# EAGLE design Sensact v3.0 a_backup (EAGLE 7.7.0)
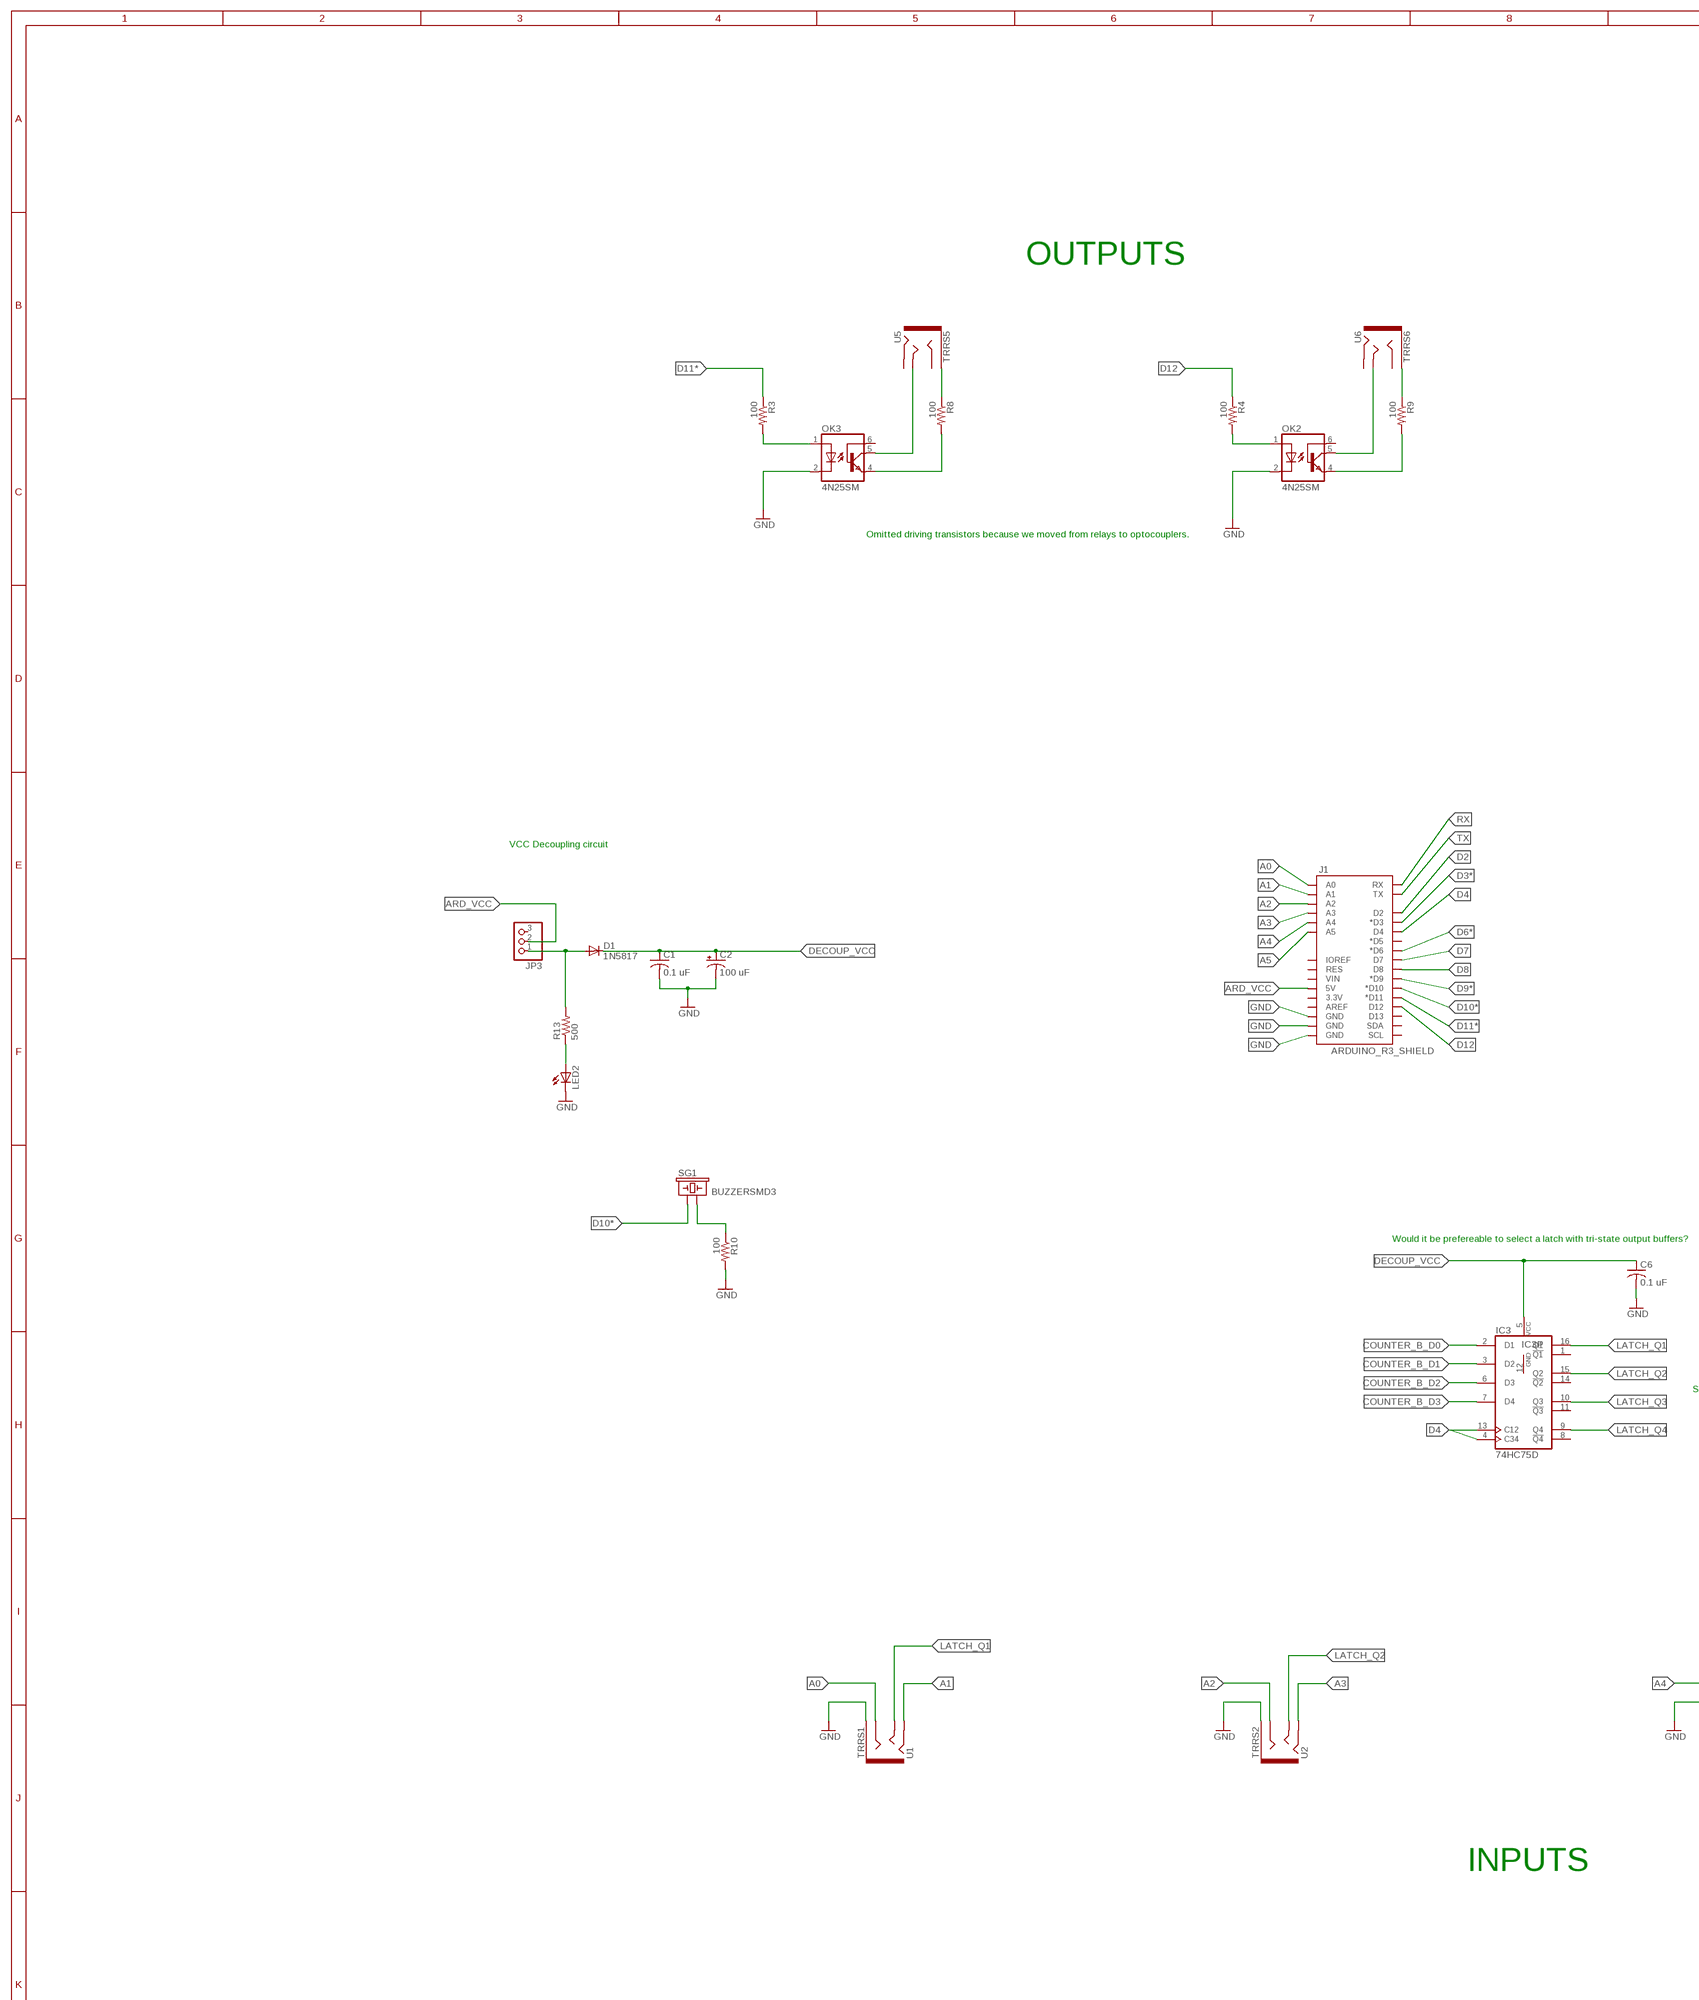
[diagram p0: schematic, sheet 1, part 1 of 3]
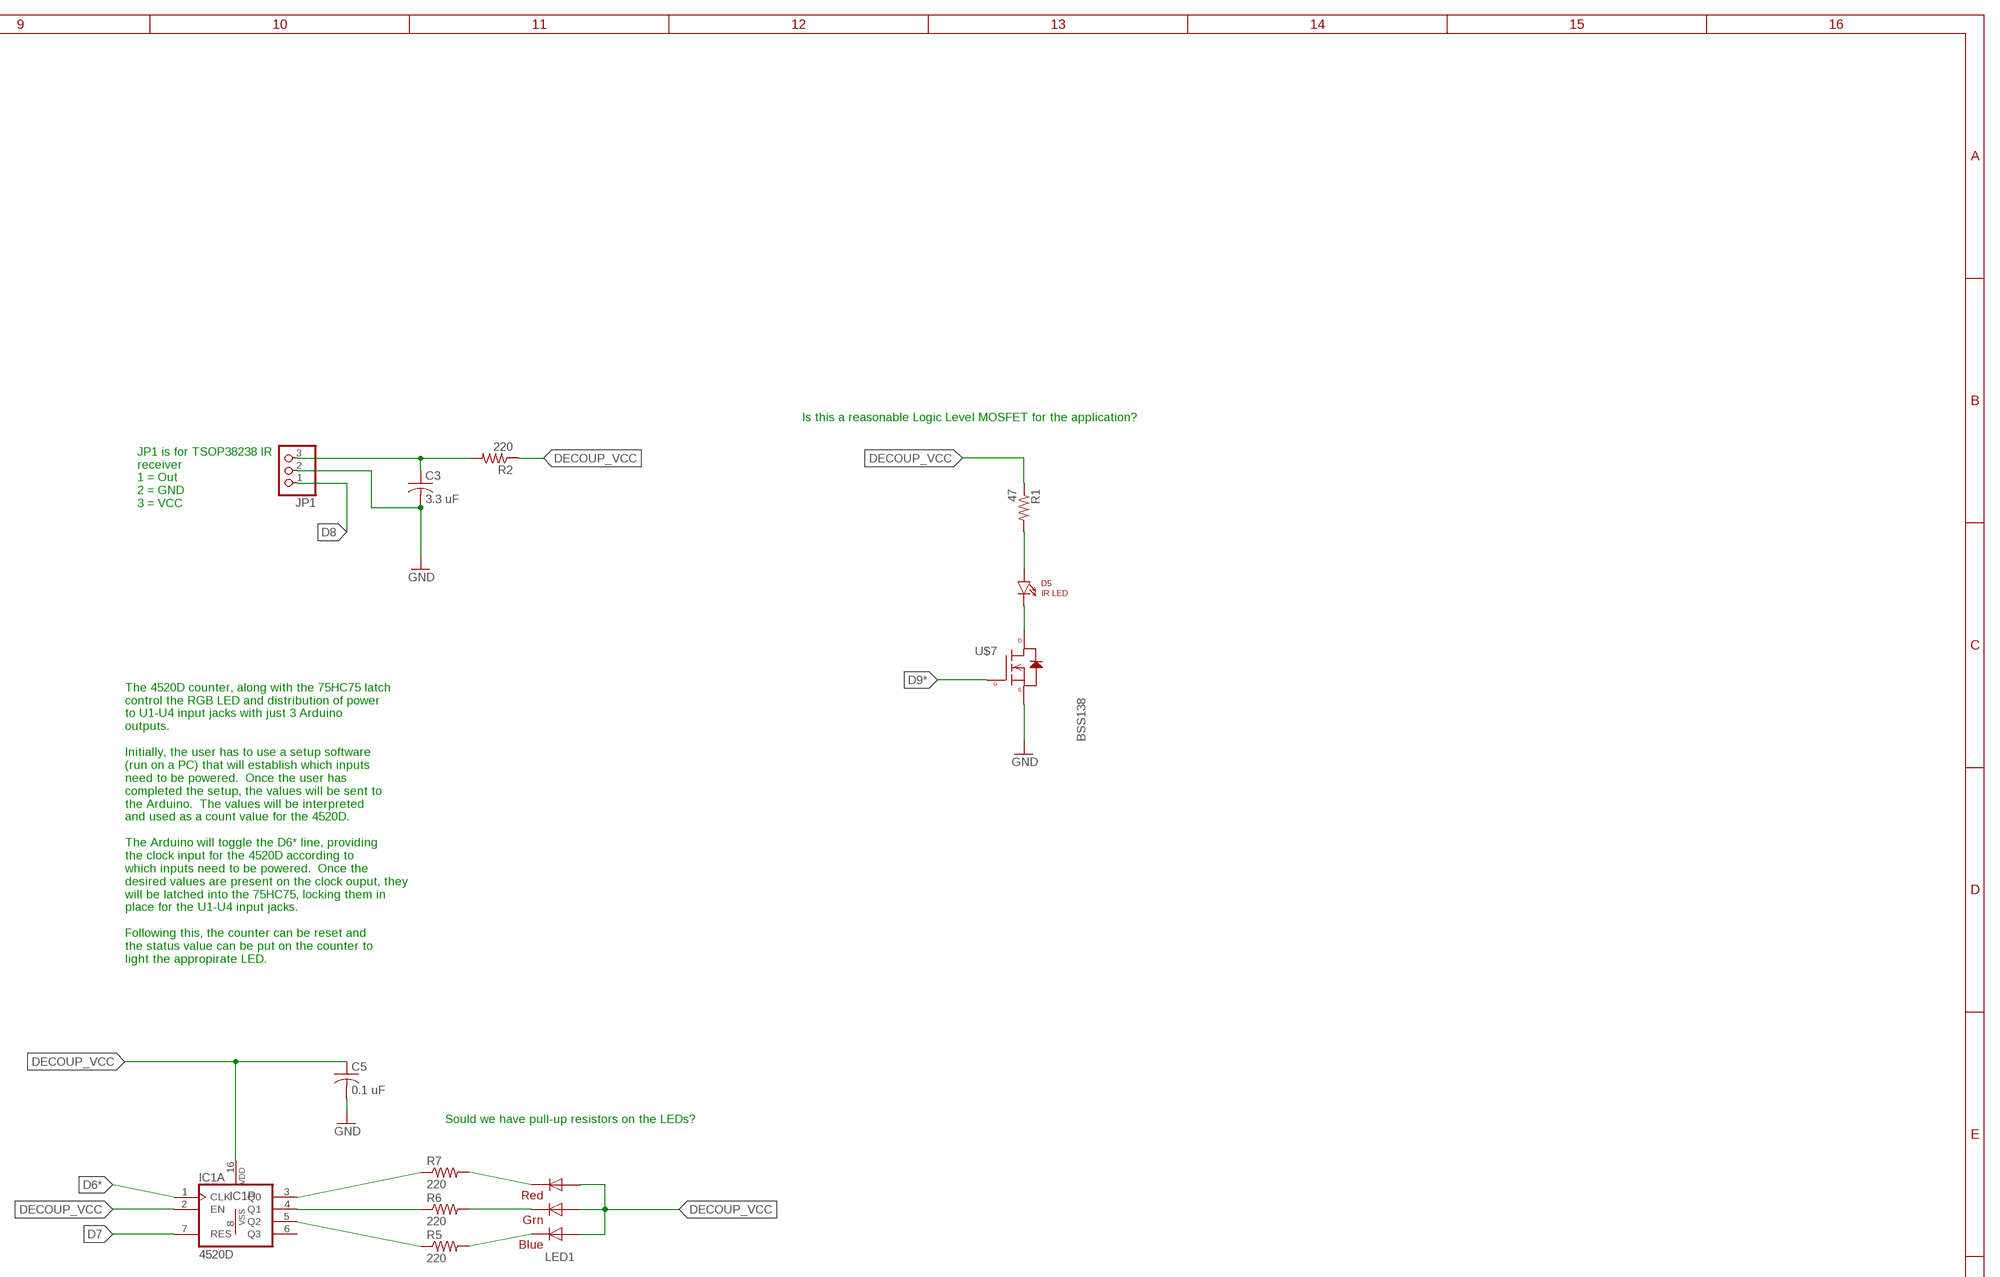
[diagram p1: schematic, sheet 1, part 2 of 3]
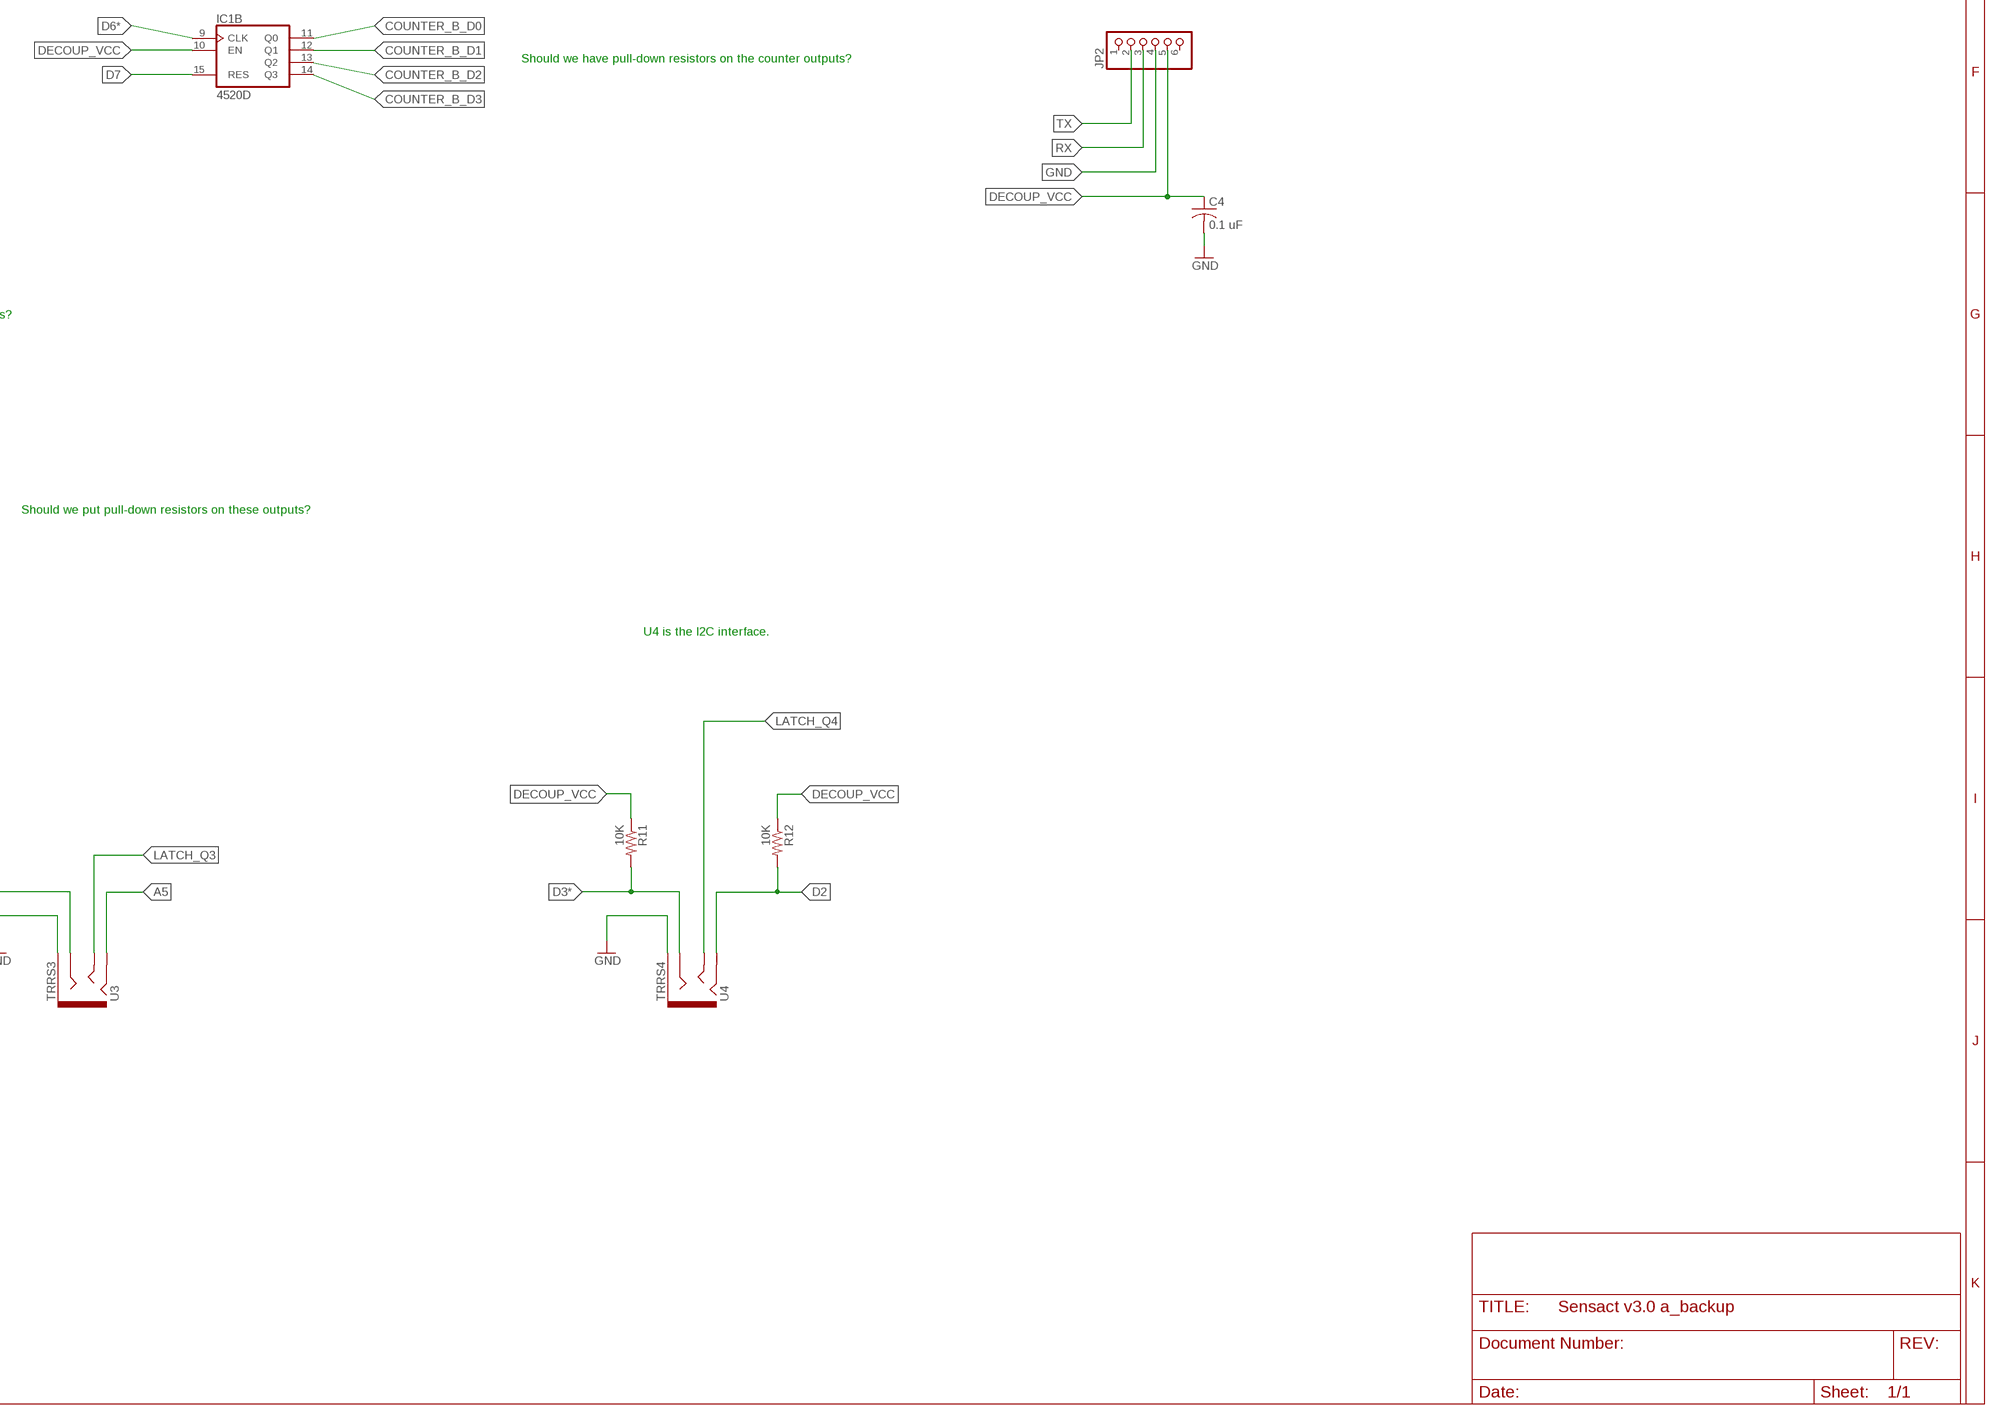
[diagram p2: schematic, sheet 1, part 3 of 3]

## Parts
C1  0.1 uF  C-USC0805  [C0805]
C2  100 uF  CAP_POLC  [PANASONIC_C]
C3  3.3 uF  C-USC0805  [C0805]
C4  0.1 uF  C-USC0805  [C0805]
C5  0.1 uF  C-USC0805  [C0805]
C6  0.1 uF  C-USC0805  [C0805]
D1  1N5817  DIODE-DO214AC  [DO214AC]
D5  IR LED  LTE-302  [LTE-302]
IC1  4520D  [SO16]
IC3  74HC75D  [SO16]
J1  ARDUINO_R3_SHIELD  [UNO_R3_SHIELD]
JP1  PINHD-1X3  [1X03]
JP2  PINHD-1X6  [1X06]
JP3  PINHD-1X3  [1X03]
LED1  RGBLED5050  [RGBLED5050]
LED2  LEDCHIPLED_0805  [CHIPLED_0805]
OK2  4N25SM  [DIL6-SMD]
OK3  4N25SM  [DIL6-SMD]
R1  47  RESISTOR0805-RES  [0805]
R2  220  RESISTOR0805-RES  [0805]
R3  100  RESISTOR0805-RES  [0805]
R4  100  RESISTOR0805-RES  [0805]
R5  220  RESISTOR0805-RES  [0805]
R6  220  RESISTOR0805-RES  [0805]
R7  220  RESISTOR0805-RES  [0805]
R8  100  R-US_R0805  [R0805]
R9  100  R-US_R0805  [R0805]
R10  100  R-US_R0805  [R0805]
R11  10K  RESISTOR0805-RES  [0805]
R12  10K  RESISTOR0805-RES  [0805]
R13  500  RESISTOR0805-RES  [0805]
SG1  BUZZERSMD3  [BUZZER-CMT1102]
TRRS1  U1  AUDIO-JACK-TRRS-THRUHOLE  [AUDIO-JACK-TRRS-THRUHOLE]
TRRS2  U2  AUDIO-JACK-TRRS-THRUHOLE  [AUDIO-JACK-TRRS-THRUHOLE]
TRRS3  U3  AUDIO-JACK-TRRS-THRUHOLE  [AUDIO-JACK-TRRS-THRUHOLE]
TRRS4  U4  AUDIO-JACK-TRRS-THRUHOLE  [AUDIO-JACK-TRRS-THRUHOLE]
TRRS5  U5  AUDIO-JACK-TRRS-THRUHOLE  [AUDIO-JACK-TRRS-THRUHOLE]
TRRS6  U6  AUDIO-JACK-TRRS-THRUHOLE  [AUDIO-JACK-TRRS-THRUHOLE]
U$7  BSS138  N-CHANNEL-MOSFET-BSS138  [SOT23-3]

## Nets
A0: J1.A0 TRRS1.RING1
A1: J1.A1 TRRS1.RING2
A2: J1.A2 TRRS2.RING1
A3: J1.A3 TRRS2.RING2
A4: J1.A4 TRRS3.RING1
A5: J1.A5 TRRS3.RING2
ARD_VCC: J1.5V JP3.2
COUNTER_B_D0: IC1.11(B:Q0) IC3.2(D1)
COUNTER_B_D1: IC1.12(B:Q1) IC3.3(D2)
COUNTER_B_D2: IC1.13(B:Q2) IC3.6(D3)
COUNTER_B_D3: IC1.14(B:Q3) IC3.7(D4)
D2: J1.D2 R12.2 TRRS4.RING2
D3*: J1.D3(*D3) R11.2 TRRS4.RING1
D4: IC3.4(C34) IC3.13(C12) J1.D4
D6*: IC1.1(A:CLK) IC1.9(B:CLK) J1.D6(*D6)
D7: IC1.7(A:RES) IC1.15(B:RES) J1.D7
D8: J1.D8 JP1.1
D9*: J1.D9(*D9) U$7.1(G)
D10*: J1.D10(*D10) SG1.1
D11*: J1.D11(*D11) R3.1
D12: J1.D12 R4.1
DECOUP_VCC: C1.1 C2.+ C4.1 C5.1 C6.1 D1.C IC1.2(A:EN) IC1.10(B:EN) IC1.16(P:VDD) IC3.5(VCC) JP2.5 LED1.1(GREEN_A) LED1.2(RED_A) LED1.3(BLUE_A) R1.1 R2.1 R11.1 R12.1
GND: C1.2 C2.- C3.2 C4.2 C5.2 C6.2 J1.GND@0(GND) J1.GND@1(GND) J1.GND@2(GND) JP1.2 JP2.4 LED2.C OK2.2(C) OK3.2(C) R10.2 TRRS1.SLEEVE(EARTH) TRRS2.SLEEVE(EARTH) TRRS3.SLEEVE(EARTH) TRRS4.SLEEVE(EARTH) U$7.2(S)
LATCH_Q1: IC3.16(Q1) TRRS1.TIP
LATCH_Q2: IC3.15(Q2) TRRS2.TIP
LATCH_Q3: IC3.10(Q3) TRRS3.TIP
LATCH_Q4: IC3.9(Q4) TRRS4.TIP
N$1: C3.1 JP1.3 R2.2
N$2: R8.1 TRRS5.SLEEVE(EARTH)
N$3: OK2.1(A) R4.2
N$4: OK3.1(A) R3.2
N$5: LED1.4(BLUE_C) R5.2
N$6: LED1.6(GREEN_C) R6.2
N$7: LED1.5(RED_C) R7.2
N$8: OK3.5(COL) TRRS5.TIP
N$9: OK3.4(EMI) R8.2
N$10: OK2.5(COL) TRRS6.TIP
N$11: R9.1 TRRS6.SLEEVE(EARTH)
N$12: LED2.A R13.1
N$13: D5.A R1.2
N$14: D5.C U$7.3(D)
N$15: OK2.4(EMI) R9.2
N$16: D1.A JP3.1 R13.2
N$17: R10.1 SG1.2
N$19: IC1.3(A:Q0) R7.1
N$20: IC1.4(A:Q1) R6.1
N$21: IC1.5(A:Q2) R5.1
RX: J1.RX JP2.3
TX: J1.TX JP2.2
Unconnected: IC1.6(A:Q3) IC3.1(!Q1) IC3.8(!Q4) IC3.11(!Q3) IC3.14(!Q2) J1.3.3V J1.AREF J1.D5(*D5) J1.D13 J1.IOREF J1.RES J1.SCL J1.SDA J1.VIN JP2.1 JP2.6 JP3.3 OK2.6(BAS) OK3.6(BAS) TRRS5.RING1 TRRS5.RING2 TRRS6.RING1 TRRS6.RING2

## Notes on the sheet
- OUTPUTS
- Is this a reasonable Logic Level MOSFET for the application?
- JP1 is for TSOP38238 IR
  receiver
  1 = Out
  2 = GND
  3 = VCC
- Omitted driving transistors because we moved from relays to optocouplers.
- The 4520D counter, along with the 75HC75 latch
  control the RGB LED and distribution of power
  to U1-U4 input jacks with just 3 Arduino
  outputs.  
  
  Initially, the user has to use a setup software
  (run on a PC) that will establish which inputs
  need to be powered.  Once the user has
  completed the setup, the values will be sent to
  the Arduino.  The values will be interpreted
  and used as a count value for the 4520D. 
  
  The Arduino will toggle the D6* line, providing
  the clock input for the 4520D according to
  which inputs need to be powered.  Once the
  desired values are present on the clock ouput, they
  will be latched into the 75HC75, locking them in
  place for the U1-U4 input jacks.  
  
  Following this, the counter can be reset and
  the status value can be put on the counter to
  light the appropirate LED.
- VCC Decoupling circuit
- Sould we have pull-up resistors on the LEDs?
- Should we have pull-down resistors on the counter outputs?
- Would it be prefereable to select a latch with tri-state output buffers?
- Should we put pull-down resistors on these outputs?
- U4 is the I2C interface.
- INPUTS

## Power pins joined to a net without a drawn wire
GND: IC3.12(GND)
VSS: IC1.8(P:VSS)

## Library data of the parts
C1 C3-C6 = adafruit:C-US: CAPACITOR, American symbol
C2 = SparkFun-Capacitors:CAP_POL: Capacitor Polarized These are standard SMD and PTH capacitors. Normally 10uF, 47uF, and 100uF in electrolytic and tantalum varieties. Always verify the external diameter of the through hole cap, it varies with capacity, voltage, and manufacturer. The EIA devices should be standard.
D1 = diode:DIODE-: DIODE
D5 = SparkFun-LED:LTE-302: Through-hole side-firing 940nm IR LED
IC1 = 45xx:4520: Dual binary up COUNTER
IC3 = 74xx-eu:74*75: 4-bit bistable LATCH
J1 = SparkFun-Boards:ARDUINO_R3_SHIELD: Shield form compatible with the Arduino Uno R3.
JP1 JP3 = adafruit:PINHD-1X3: PIN HEADER
JP2 = adafruit:PINHD-1X6: PIN HEADER
LED1 = adafruit:RGBLED: For 5050 RGB LEDs, the order of the LEDs may vary from one manufacturer to another!
LED2 = adafruit:LED: LED OSRAM: - CHIPLED LG R971, LG N971, LY N971, LG Q971, LY Q971, LO R971, LY R971 LH N974, LH R974 LS Q976, LO Q976, LY Q976 LO Q996 - Hyper CHIPLED LW Q18S LB Q993, LB Q99A, LB R99A - SideLED LS A670, LO A670, LY A670, LG A670, LP A670 LB A673, LV A673, LT A673, LW A673 LH A674 LY A675 LS A676, LA A676, LO A676, LY A676, LW A676 LS A679, LY A679, LG A679 - Hyper Micro SIDELED® LS Y876, LA Y876, LO Y876, LY Y876 LT Y87S - SmartLED LW L88C, LW L88S LB L89C, LB L89S, LG L890 LS L89K, LO L89K, LY L89K LS L896, LA L896, LO L896, LY L896 - TOPLED LS T670, LO T670, LY T670, LG T670, LP T670 LSG T670, LSP T670, LSY T670, LOP T670, LYG T670 LG T671, LOG T671, LSG T671 LB T673, LV T673, LT T673, LW T673 LH T674 LS T676, LA T676, LO T676, LY T676, LB T676, LH T676, LSB T676, LW T676 LB T67C, LV T67C, LT T67C, LS T67K, LO T67K, LY T67K, LW E67C LS E67B, LA E67B, LO E67B, LY E67B, LB E67C, LV E67C, LT E67C LW T67C LS T679, LY T679, LG T679 LS T770, LO T770, LY T770, LG T770, LP T770 LB T773, LV T773, LT T773, LW T773 LH T774 LS E675, LA E675, LY E675, LS T675 LS T776, LA T776, LO T776, LY T776, LB T776 LHGB T686 LT T68C, LB T68C - Hyper Mini TOPLED® LB M676 - Mini TOPLED Santana® LG M470 LS M47K, LO M47K, LY M47K Source: http://www.osram.convergy.de/
OK2 OK3 = optocoupler:4N*?M: General Purpose 6-Pin Phototransistor Optocouplers Source: http://www.fairchildsemi.com/ds/4N/4N35-M.pdf; MF: FAIRCHILD SEMICONDUCTOR; MPN: 4N25SM; OC_FARNELL: 1021152; OC_NEWARK: 34C2020
R1-R7 R11-R13 = SparkFun-Passives:RESISTOR: Resistor Basic schematic elements and footprints for 0603, 1206, and PTH resistors.
R8-R10 = rcl:R-US_: RESISTOR, American symbol
SG1 = SparkFun-Electromechanical:BUZZER: Buzzer 12mm Spark Fun Electronics SKU : Comp-Buzzer
TRRS1-TRRS6 = bruce_library:AUDIO-JACK-TRRS-THRUHOLE
U$7 = GeekAmmo:N-CHANNEL-MOSFET: N-Channel MOSFET Mode Field Effect Transistor; DATASHEET: http://www.fairchildsemi.com/ds/BS/BSS138.pdf; DIGIKEY: BSS138TR-ND; ELEMENT14: 2323154; URL: http://au.element14.com/fairchild-semiconductor/bss138/mosfet-n-ch-50v-220ma-sot-23/dp/2323154

## Net classes
0 default: width 0.305 mm, drill 0.508 mm, clearance 0.254 mm

## Board
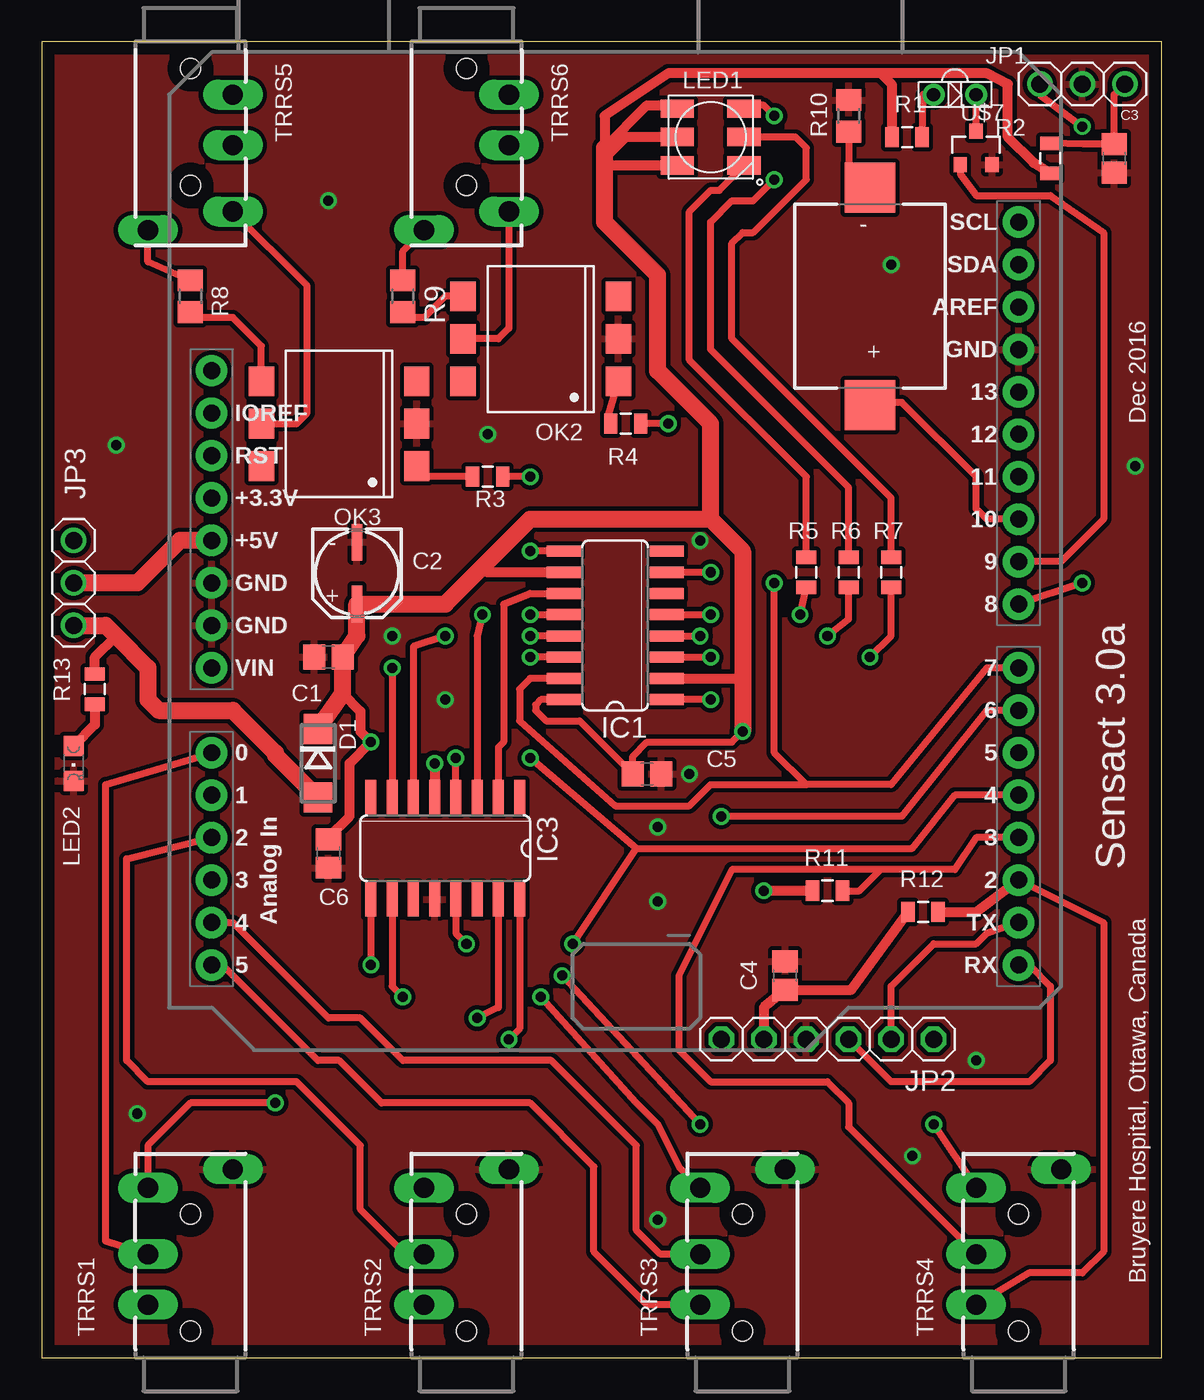
[diagram p3: board, top side]
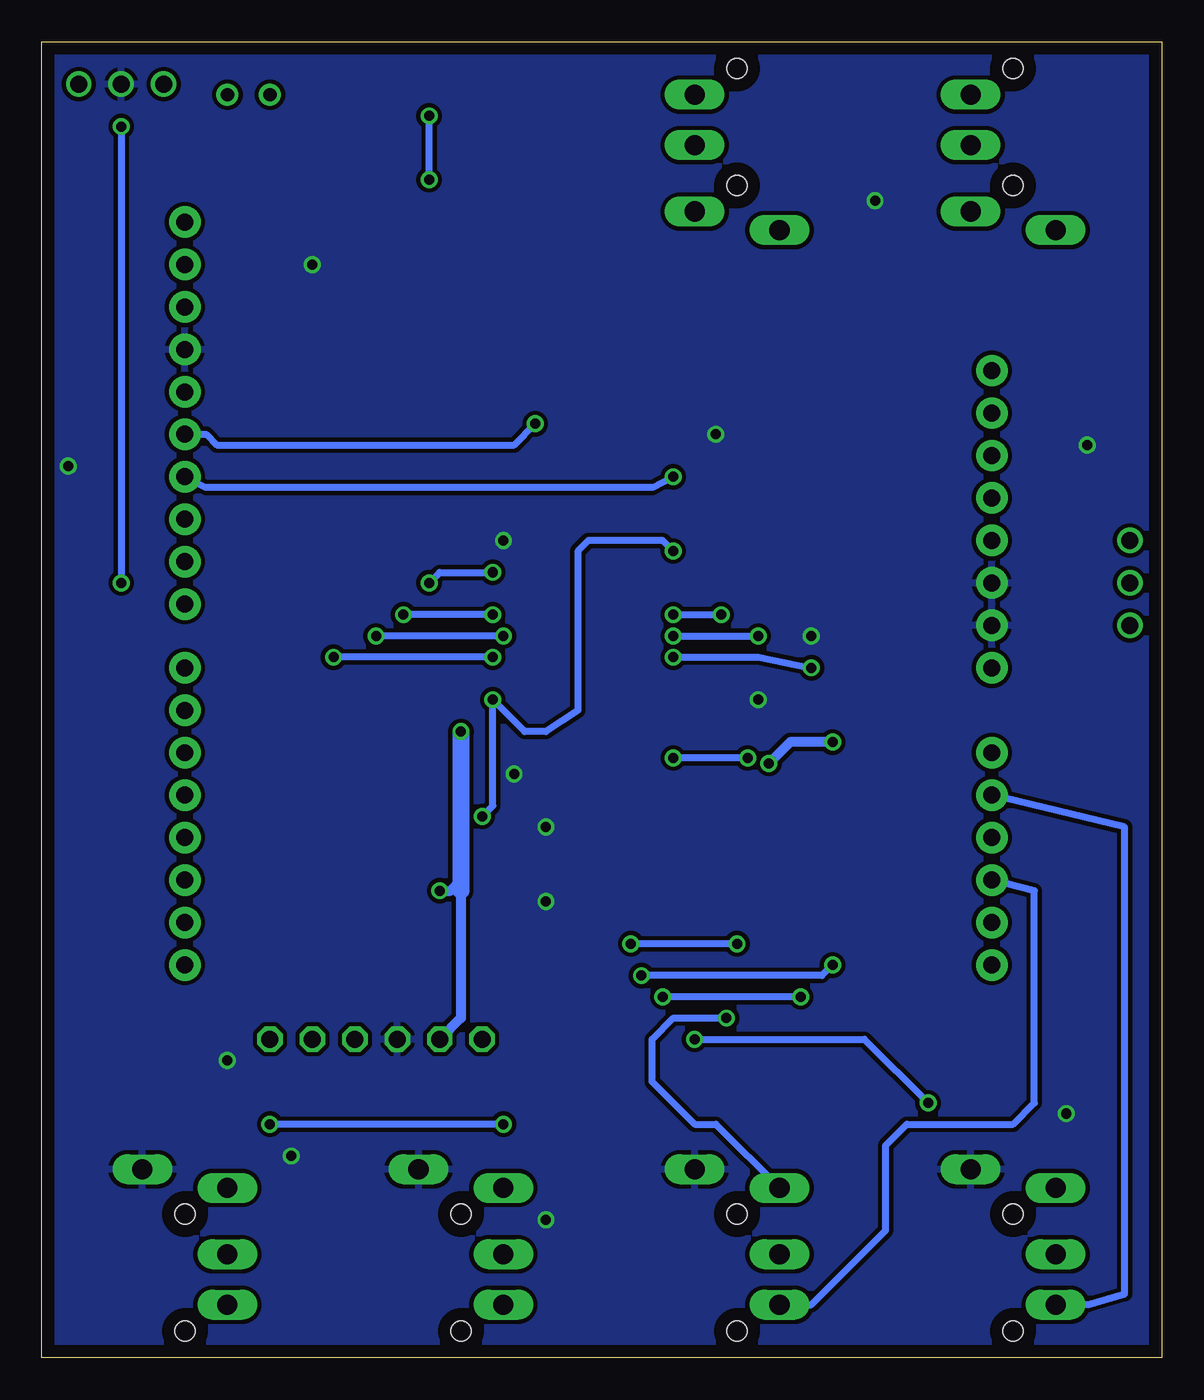
[diagram p4: board, bottom side, seen from below]

Size 66.98 x 78.73 mm. Coordinates in mm from the lower left corner, seen from the top.
Outline: 0,0 66.98,0 66.98,78.73 0,78.73 0,0
Copper layers (1*16): Top 0.035mm / dielectric 1.5mm / Bottom 0.035mm
Design rules "default *": minimum track width 10mil, minimum drill 20mil, track to track 8mil, track to pad 8mil, pad to pad 8mil, via to via 8mil, smd to smd 8mil, copper to edge 30mil, drill to drill 8mil, minimum pad ring 10mil, minimum via ring 8mil, stop-mask expansion 4mil, vias tented up to drill 0mil, thermal gap 10mil

### Footprints (pad centres in the part's own frame; a part is rotated, then mirrored left to right if it is on the bottom)
C0805 = smd 1.3 x 1.5: 1 -0.85,0; 2 0.85,0
PANASONIC_C = smd 2.2 x 0.65: + 1.9,-0.2; - -1.8,-0.2
DO214AC = smd 1.8 x 1.7: A 2.05,0; C -2.05,0
LTE-302 = drill 0.8: A 1.27,0; C -1.27,0
SO16 = smd 0.66 x 2.032: 1 -4.445,-3.073; 2 -3.175,-3.073; 3 -1.905,-3.073; 4 -0.635,-3.073; 5 0.635,-3.073; 6 1.905,-3.073; 7 3.175,-3.073; 8 4.445,-3.073; 9 4.445,3.073; 10 3.175,3.073; 11 1.905,3.073; 12 0.635,3.073; 13 -0.635,3.073; 14 -1.905,3.073; 15 -3.175,3.073; 16 -4.445,3.073
UNO_R3_SHIELD = drill 1.016 pad 1.88: 3.3V 50.8,26.67; 5V 50.8,29.21; A0 50.8,41.91; A1 50.8,44.45; A2 50.8,46.99; A3 50.8,49.53; A4 50.8,52.07; A5 50.8,54.61; AREF 2.54,15.24; D2 2.54,49.53; D3 2.54,46.99; D4 2.54,44.45; D5 2.54,41.91; D6 2.54,39.37; D7 2.54,36.83; D8 2.54,33.02; D9 2.54,30.48; D10 2.54,27.94; D11 2.54,25.4; D12 2.54,22.86; D13 2.54,20.32; GND@0 50.8,31.75; GND@1 50.8,34.29; GND@2 2.54,17.78; IOREF 50.8,21.59; NC 50.8,19.05; RES 50.8,24.13; RX 2.54,54.61; SCL 2.54,10.16; SDA 2.54,12.7; TX 2.54,52.07; VIN 50.8,36.83
1X03 = drill 1.016: 1 -2.54,0; 2 0,0; 3 2.54,0
1X06 = drill 1.016 octagon: 1 -6.35,0; 2 -3.81,0; 3 -1.27,0; 4 1.27,0; 5 3.81,0; 6 6.35,0
RGBLED5050 = smd 2 x 1.1: 1 -2,1.7; 2 -2,0; 3 -2,-1.7; 4 2,-1.7; 5 2,0; 6 2,1.7
CHIPLED_0805 = smd 1.2 x 1.2: A 0,-1.05; C 0,1.05
DIL6-SMD = smd 1.78 x 1.52: 1 -2.54,-4.645; 2 0,-4.645; 3 2.54,-4.645; 4 2.54,4.645; 5 0,4.645; 6 -2.54,4.645
0805 = smd 0.8 x 1.2: 1 -0.9,0; 2 0.9,0
R0805 = smd 1.3 x 1.5: 1 -0.95,0; 2 0.95,0
BUZZER-CMT1102 = smd 3 x 3: 1 -6.5,0; 2 6.5,0
AUDIO-JACK-TRRS-THRUHOLE = drill 1.2 long: RING1 6.191,2.54; RING2 3.175,2.54; SLEEVE 11.271,-2.54; TIP 10.16,2.54 | hole 1.2: 1.6,0; 8.6,0
SOT23-3 = smd 0.8 x 0.9: 1 -0.95,-1; 2 0.95,-1; 3 0,1

### Placement (x,y rotation side)
C1  17.14,41.91 180 top
C2  19.05,46.99 270 top
C3  64.14,71.75 270 top
C4  44.45,22.86 90 top
C5  36.2,34.92 0 top
C6  17.14,30.16 270 top
D1  16.51,35.56 270 top
D5  54.61,75.56 180 top
IC1  34.29,43.81 90 top
IC3  24.13,30.48 180 top
J1  60.96,78.11 180 top
JP1  62.23,76.2 0 top
JP2  46.99,19.05 180 top
JP3  1.91,46.35 90 top
LED1  40.01,73.03 0 top
LED2  1.91,35.56 180 top
OK2  29.84,60.96 90 top
OK3  17.78,55.88 90 top
R1  51.75,73.03 0 top
R2  60.33,71.75 90 top
R3  26.67,52.7 180 top
R4  34.92,55.88 180 top
R5  45.72,46.99 90 top
R6  48.26,46.99 90 top
R7  50.8,46.99 90 top
R8  8.89,63.5 270 top
R9  21.59,63.5 270 top
R10  48.26,74.3 90 top
R11  46.99,27.94 0 top
R12  52.7,26.67 0 top
R13  3.17,40.01 90 top
SG1  49.53,63.5 90 top
TRRS1  8.89,0 90 top
TRRS2  25.4,0 90 top
TRRS3  41.91,0 90 top
TRRS4  58.42,0 90 top
TRRS5  8.89,78.74 270 top
TRRS6  25.4,78.74 270 top
U$7  55.88,72.39 0 top

### Tracks (layer width: path | path; a pad name or v marks a point on that pad's centre or on a via)
A0
  Top 0.406: J1.A0 3.81,34.29 3.81,6.99 TRRS1.RING1
A1
  Bottom 0.406: J1.A1 2.22,31.75 2.22,3.81 4.45,3.17 TRRS1.RING2
A2
  Top 0.406: TRRS2.RING1 21.75,6.19 19.05,8.89 19.05,12.7 15.24,16.51 6.35,16.51 5.08,17.78 5.08,29.84 J1.A2
A3
  Bottom 0.406: TRRS2.RING2 20.95,3.17 16.51,7.62 16.51,12.7 15.24,13.97 8.89,13.97 7.62,15.24 7.62,27.94 J1.A3
A4
  Top 0.406: TRRS3.RING1 36.99,6.19 35.56,7.62 35.56,12.7 30.48,17.78 21.59,17.78 19.05,20.32 17.14,20.32 11.43,26.04 J1.A4
A5
  Top 0.406: TRRS3.RING2 36.2,3.17 33.02,6.35 33.02,11.43 29.21,15.24 20.32,15.24 17.78,17.78 16.51,17.78 10.79,23.5 J1.A5
ARD_VCC
  Top 1.016: J1.5V 8.26,48.9 5.71,46.35 JP3.2
COUNTER_B_D0
  Top 0.406: IC1.11 29.21,45.72 27.62,45.09 27.62,36.83 27.3,36.51 IC3.2
COUNTER_B_D1  (via drill 0.6)
  Top 0.406: v26.35,44.45 26.04,43.18 IC3.3 | v29.21,44.45 IC1.12
  Bottom 0.406: v29.21,44.45 v26.35,44.45
COUNTER_B_D2  (via drill 0.6)
  Top 0.406: IC1.13 v29.21,43.18 | v24.13,43.18 22.23,42.55 IC3.6
  Bottom 0.406: v29.21,43.18 v24.13,43.18
COUNTER_B_D3  (via drill 0.6)
  Top 0.406: IC1.14 v29.21,41.91 | v20.95,41.27 IC3.7
  Bottom 0.406: v29.21,41.91 24.13,41.91 v20.95,41.27
D2
  Top 0.406: J1.D2 63.5,26.04 63.5,6.35 62.23,5.08 59.05,5.08 TRRS4.RING2
  Top 0.61: R12.2 55.88,26.67 J1.D2
D3*
  Top 0.406: J1.D3 55.88,31.11 54.61,29.21 50.16,29.21 | 50.16,29.21 41.27,29.21 38.1,22.86 38.1,18.41 40.01,16.51 46.99,16.51 48.26,15.24 48.26,13.81 TRRS4.RING1 | R11.2 48.9,27.94 50.16,29.21
D4  (via drill 0.6)
  Top 0.406: v29.21,35.88 35.56,30.48 | 35.56,30.48 52.07,30.48 54.61,33.66 J1.D4 | IC3.13 24.77,25.4 v25.4,24.77 | v31.75,24.77 35.56,30.48 | IC3.4 v24.77,35.88
  Bottom 0.406: v24.77,35.88 v29.21,35.88 | v25.4,24.77 v31.75,24.77
D6*  (via drill 0.6)
  Top 0.406: J1.D6 56.52,38.73 51.44,32.38 v40.64,32.38 | v40.01,39.37 IC1.1 | IC1.9 v29.21,48.26
  Bottom 0.406: v40.64,32.38 40.01,33.02 v40.01,39.37 38.1,37.47 36.83,37.47 34.92,38.73 34.92,48.26 34.29,48.9 29.84,48.9 v29.21,48.26
D7  (via drill 0.6)
  Top 0.406: J1.D7 56.52,41.27 50.8,34.29 45.72,34.29 | 45.72,34.29 43.81,36.2 v43.81,46.35 | v40.01,46.99 IC1.7 | IC1.15 29.21,40.64 28.57,40.01 28.57,38.1 34.29,33.02 38.73,33.02 40.01,34.29 45.72,34.29
  Bottom 0.406: v43.81,46.35 43.18,46.99 v40.01,46.99
D8  (via drill 0.6)
  Top 0.406: JP1.1 59.69,75.56 v62.23,73.66 | v62.23,46.35 J1.D8
  Bottom 0.406: v62.23,73.66 v62.23,46.35
D9*
  Top 0.406: U$7.1 54.93,70.8 55.88,69.53 60.33,69.53 63.5,67.31 63.5,50.16 60.96,47.62 J1.D9
D10*
  Top 0.406: J1.D10 56.52,50.16 55.88,50.8 55.88,52.7 51.44,57.15 49.68,57.15 SG1.1
D11*  (via drill 0.6)
  Top 0.406: v29.21,52.7 R3.1
  Bottom 0.406: J1.D11 57.15,52.07 30.48,52.07 v29.21,52.7
D12  (via drill 0.6)
  Top 0.406: v37.47,55.88 R4.1
  Bottom 0.406: v37.47,55.88 38.73,54.61 56.52,54.61 57.15,55.24 J1.D12
DECOUP_VCC  (via drill 0.6)
  Top 0.406: v41.91,37.47 41.27,36.83 36.2,36.83 35.34,35.98 C5.1 32.17,38.1 30.16,38.1 29.53,38.73 29.53,39.05 29.84,39.37 IC1.16
  Top 0.61: JP2.5 43.18,20.95 C4.1 48.41,22.01 R12.1 | 18,39.73 19.05,38.67 19.05,37.47 v19.68,36.83 18.41,35.56 18.41,32.38 17.14,31.11 C6.1 | IC1.2 41.91,40.64 | IC1.10 26.67,46.99 26.35,47.31 | R11.1 v43.18,27.94 | 33.66,72.39 36.2,74.93 37.8,74.93 LED1.1 | LED1.2 34.92,73.03 33.66,71.75 34.09,71.33 LED1.3 | R2.1 59.32,71.49 57.78,73.03 57.78,76.2 56.52,76.83 50.16,76.83 | 50.16,76.83 37.47,76.83 33.66,74.3 33.66,71.12 | R1.1 50.85,76.15 50.16,76.83 | v23.5,35.56 IC3.5
  Top 1.016: D1.C 18,39.73 C1.1 18.85,43.18 C2.+ 24.14,45.09 26.35,47.31 29.21,50.16 40.01,50.16 | 40.01,50.16 41.91,48.26 41.91,40.64 v41.91,37.47 | 40.01,50.16 40.01,55.88 36.83,59.05 36.83,64.77 33.66,67.94 33.66,71.12 33.66,71.75 33.66,72.39
  Bottom 0.61: v19.68,36.83 22.23,36.83 v23.5,35.56 | 41.91,27.94 41.91,20.32 JP2.5 | v43.18,27.94 42.55,27.94 41.91,28.57
  Bottom 1.016: v41.91,37.47 41.91,28.57 41.91,27.94
GND  (via drill 0.6)
  other vias: 36.83,27.3 5.71,14.61 36.83,8.26 52.07,12.06 55.88,17.78 38.73,34.92 39.37,48.9 4.45,54.61 65.41,53.34 26.67,55.24 17.14,69.22 50.8,65.41 36.83,31.75 24.13,39.37 20.95,43.18
  pour Top: 67.94,79.38 -0.64,79.38 -0.64,-0.64 67.94,-0.64
  pour Bottom: -0.64,79.38 -0.64,-0.64 67.94,-0.64 67.94,79.38
LATCH_Q1  (via drill 0.6)
  Top 0.406: IC3.16 28.57,19.68 v27.94,19.05 | v13.97,15.24 8.89,15.24 6.35,12.7 TRRS1.TIP
  Bottom 0.406: v27.94,19.05 17.78,19.05 v13.97,15.24
LATCH_Q2  (via drill 0.6)
  Top 0.406: IC3.15 27.3,20.95 v26.04,20.32
  Bottom 0.406: TRRS2.TIP 26.67,13.97 27.94,13.97 30.48,16.51 30.48,19.05 29.21,20.32 v26.04,20.32
LATCH_Q3  (via drill 0.6)
  Top 0.406: IC3.10 20.95,22.23 v21.59,21.59 | v29.84,21.59 35.56,15.24 36.83,13.97 38.1,11.43 TRRS3.TIP
  Bottom 0.406: v21.59,21.59 v29.84,21.59
LATCH_Q4  (via drill 0.6)
  Top 0.406: IC3.9 v19.68,23.5 | v31.11,22.86 v39.37,13.97 | v53.34,13.97 TRRS4.TIP
  Bottom 0.406: v19.68,23.5 20.32,22.86 v31.11,22.86 | v39.37,13.97 v53.34,13.97
N$1
  Top 0.406: R2.2 62.28,72.61 C3.1 64.14,75.56 JP1.3
N$2
  Top 0.406: R8.1 6.35,65.56 TRRS5.SLEEVE
N$3
  Top 0.406: OK2.1 33.85,56.34 R4.2
N$4
  Top 0.406: R3.2 23.06,52.7 OK3.1
N$5
  Top 0.406: R5.2 45.72,52.7 38.73,59.69 38.73,68.58 40.01,69.85 40.53,69.85 LED1.4
N$6  (via drill 0.6)
  Top 0.406: R6.2 48.26,52.07 40.01,60.33 40.01,67.94 41.27,69.22 42.55,69.22 v43.81,70.48 | v43.81,74.3 43.18,74.93 42.21,74.93 LED1.6
  Bottom 0.406: v43.81,70.48 v43.81,74.3
N$7
  Top 0.406: R7.2 50.8,51.44 41.27,60.96 41.27,66.67 41.91,67.31 42.55,67.31 45.72,70.48 45.72,72.39 45.09,73.03 LED1.5
N$8
  Top 0.406: OK3.5 15.24,55.88 15.88,56.52 15.88,64.14 TRRS5.TIP
N$9
  Top 0.406: OK3.4 13.13,60.52 11.43,62.23 9.21,62.23 R8.2
N$10
  Top 0.406: TRRS6.TIP 27.94,61.59 27.3,60.96 OK2.5
N$11
  Top 0.406: R9.1 21.59,66.2 TRRS6.SLEEVE
N$12
  Top 0.61: R13.1 3.17,37.88 LED2.A
N$13
  Top 0.406: R1.2 52.7,75.56 D5.A
N$14
  Top 0.406: U$7.3 D5.C
N$15
  Top 0.406: OK2.4 24.13,63.5 22.86,62.23 21.91,62.23 R9.2
N$16
  Top 0.61: R13.2 3.17,41.91 4.45,43.18
  Top 1.016: JP3.1 3.81,43.81 4.45,43.18 6.35,41.27 6.35,39.37 6.99,38.73 11.43,38.73 13.97,36.2 13.97,36.05 D1.A
N$17
  Top 0.406: R10.1 48.26,71.27 SG1.2
N$19  (via drill 0.6)
  Top 0.406: IC1.3 v40.01,41.91 | v49.53,41.91 50.8,43.18 R7.1
  Bottom 0.406: v40.01,41.91 v49.53,41.91
N$20  (via drill 0.6)
  Top 0.406: IC1.4 v39.37,43.18 | v46.99,43.18 48.26,44.19 R6.1
  Bottom 0.406: v39.37,43.18 v46.99,43.18
N$21  (via drill 0.6)
  Top 0.406: IC1.5 v40.01,44.45 | v45.35,44.45 R5.1
  Bottom 0.406: v40.01,44.45 v45.35,44.45
RX
  Top 0.406: JP2.3 50.8,16.51 59.05,16.51 60.33,17.78 60.33,22.23 59.05,23.5 J1.RX
TX
  Top 0.406: J1.TX 56.52,25.4 55.88,24.77 53.34,24.77 50.8,22.23 JP2.2

### Text on the board
tPlace: - | + | Dec 2016 | - | + | Sensact 3.0a | Bruyere Hospital, Ottawa, Canada